# EAGLE design working (EAGLE 9.6.2)
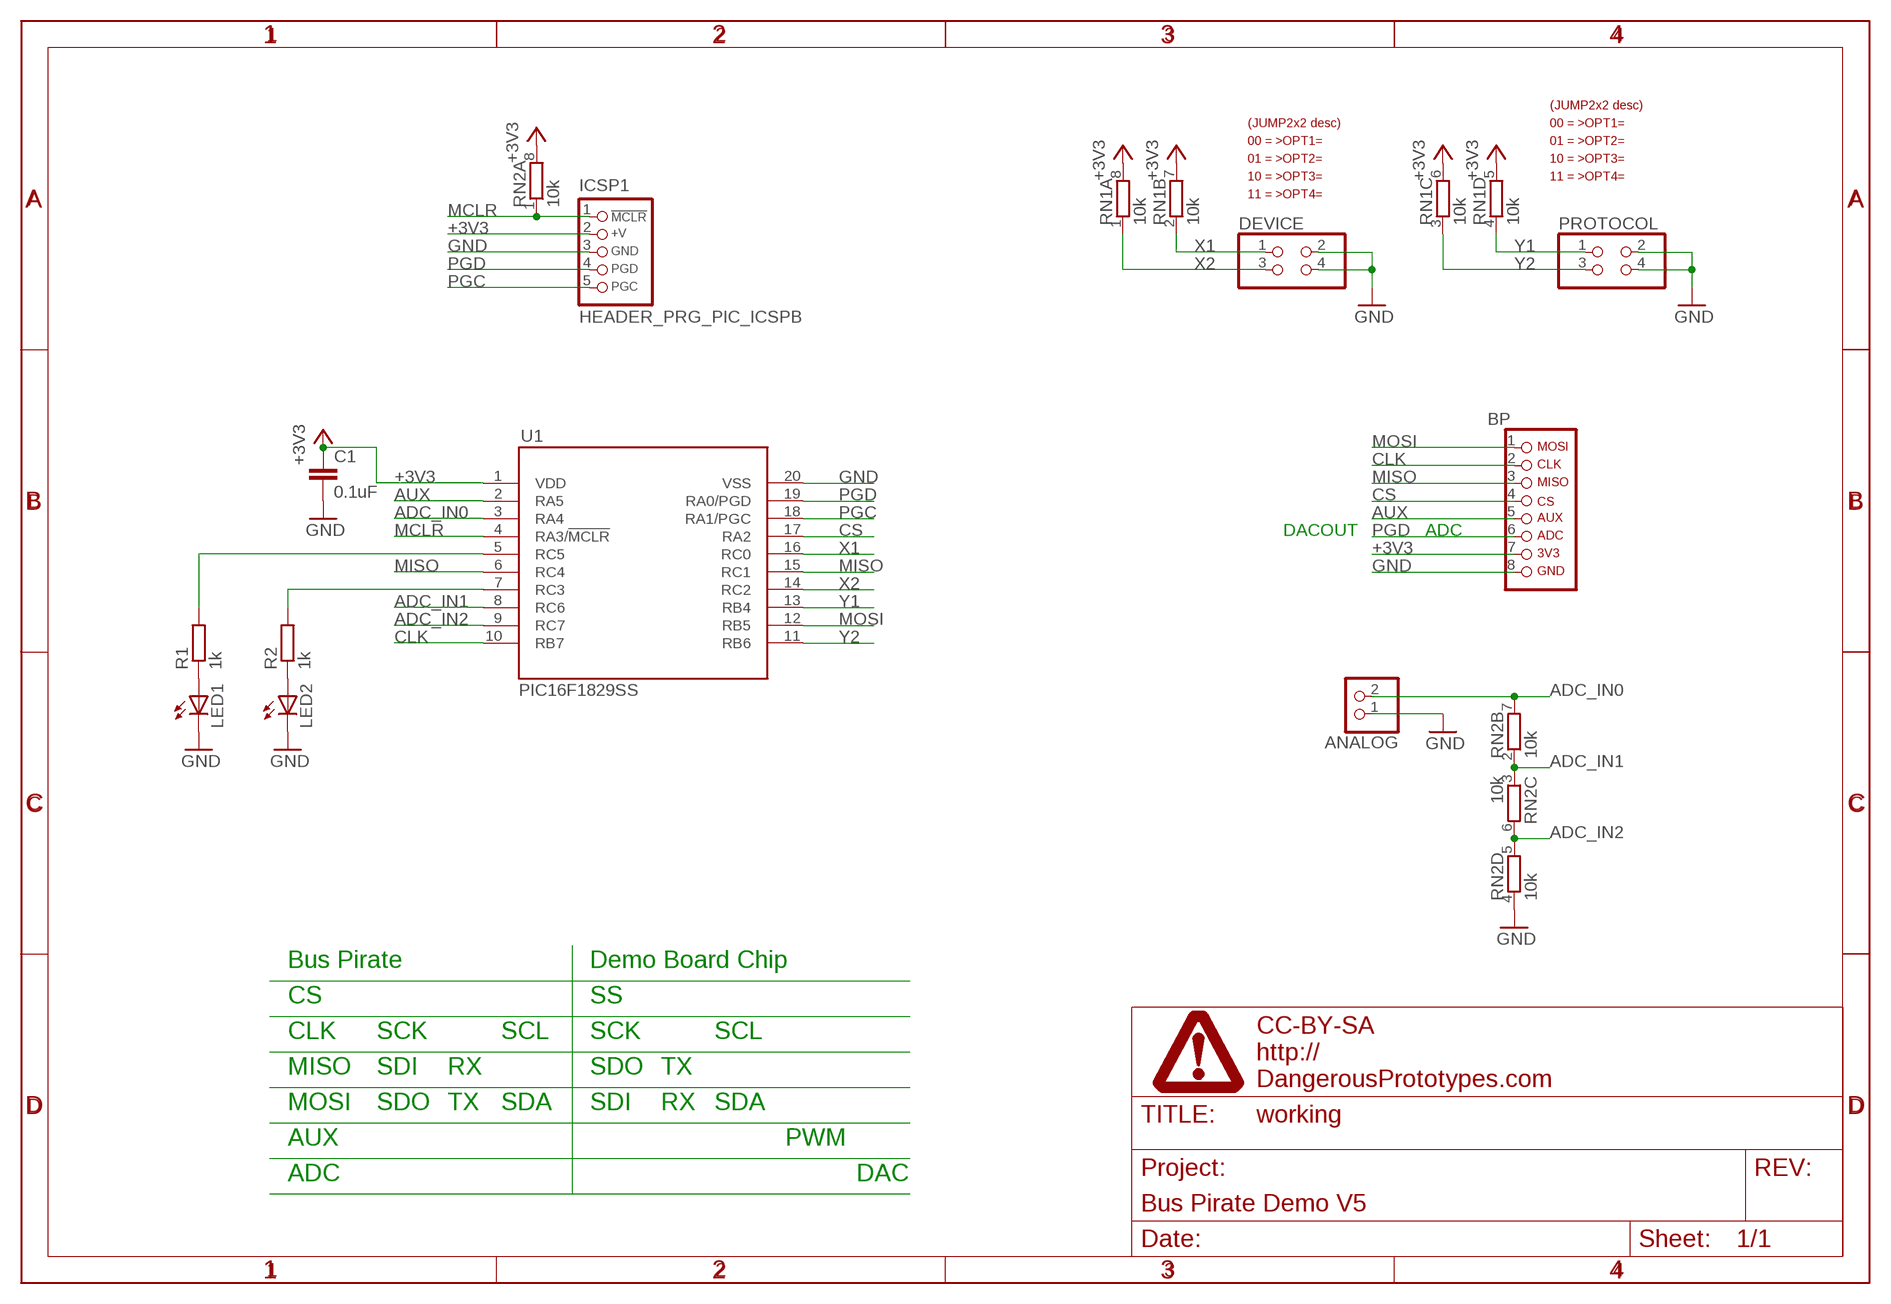
[diagram p0: schematic, sheet 1]

## Parts
ANALOG  PINHD-1X2  [1X02]
BP  HDR-BUSPIRATE  [HDR-BUSPIRATE]
C1  0.1uF  CAPC603  [C603]
DEVICE  PINHD-2X2  [2X02]
ICSP1  HEADER_PRG_PIC_ICSPB  [HEADER_PRG_1X05_ICSP_B]
LED1  LED805  [LED-805]
LED2  LED805  [LED-805]
PROTOCOL  PINHD-2X2  [2X02]
R1  1k  RESISTORR603  [R603]
R2  1k  RESISTORR603  [R603]
RN1  10k  RNETWORK  [RN8P-4R-CRA06S]
RN2  10k  RNETWORK  [RN8P-4R-CRA06S]
U1  PIC16F1829SS  [SSOP20]
U$1  DINA4_L  [DP_LOGO]
U$9  JUMP2X2_DESC  [JUMP2X2_DESC]
U$10  JUMP2X2_DESC  [JUMP2X2_DESC]

## Nets
+3V3: BP.7 C1.1 ICSP1.2(+V) RN1.5 RN1.6 RN1.7 RN1.8 RN2.8 U1.1(VDD)
ADC_IN0: ANALOG.2 RN2.7 U1.3(RA4)
ADC_IN1: RN2.2 RN2.3 U1.8(RC6)
ADC_IN2: RN2.5 RN2.6 U1.9(RC7)
AUX: BP.5 U1.2(RA5)
CLK: BP.2 U1.10(RB7)
CS: BP.4 U1.17(RA2)
GND: ANALOG.1 BP.8 C1.2 DEVICE.2 DEVICE.4 ICSP1.3(GND) LED1.C LED2.C PROTOCOL.2 PROTOCOL.4 RN2.4 U1.20(VSS)
MCLR: ICSP1.1(/MCLR) RN2.1 U1.4(RA3/!MCLR)
MISO: BP.3 U1.6(RC4) U1.15(RC1)
MOSI: BP.1 U1.12(RB5)
N$1: R1.2 U1.5(RC5)
N$2: LED1.A R1.1
N$7: LED2.A R2.1
N$10: R2.2 U1.7(RC3)
PGC: ICSP1.5(PGC) U1.18(RA1/PGC)
PGD: BP.6 ICSP1.4(PGD) U1.19(RA0/PGD)
X1: DEVICE.1 RN1.2 U1.16(RC0)
X2: DEVICE.3 RN1.1 U1.14(RC2)
Y1: PROTOCOL.1 RN1.4 U1.13(RB4)
Y2: PROTOCOL.3 RN1.3 U1.11(RB6)

## Notes on the sheet
- DACOUT | ADC
- Bus Pirate | Demo Board Chip
- CS | SS
- CLK | SCK | SCL | SCK | SCL
- MISO | SDI | RX | SDO | TX
- MOSI | SDO | TX | SDA | SDI | RX | SDA
- AUX | PWM
- ADC | DAC

## Library data of the parts
ANALOG = pinhead:PINHD-1X2: PIN HEADER
BP = dp_devices:HDR-BUSPIRATE: PIN HEADER
C1 = dp_devices:CAP
DEVICE PROTOCOL = pinhead:PINHD-2X2: PIN HEADER
ICSP1 = dp_devices:HEADER_PRG_PIC_ICSP: 5-pin PIC In Circuit Serial Programming header
LED1 LED2 = dp_devices:LED
R1 R2 = dp_devices:RESISTOR
RN1 RN2 = dp_devices:RNETWORK: 4 Resistor Array 0603
U1 = dp_devices:PIC16F1829
U$1 = dp_devices:DINA4_L: A4 DP frame Standard Dangerous Prototypes schematic frame. Automagically adds the DP logo and standard texts to the PCB Use the atrribute in the schematic editor to change the fields.; FF1: fulfillment by; FF2: Seeed Studio; FF3: www.seeedstudio.com; LICENSE: CC-BY-SA; PROJECT: Bus Pirate Demo V5; URL1: http://; URL2: DangerousPrototypes.com
U$9 = dp_devices:JUMP2X2_DESC; OPT1: SPI; OPT2: I2C; OPT3: UART; OPT4: ____
U$10 = dp_devices:JUMP2X2_DESC; OPT1: ADC; OPT2: DAC; OPT3: MEM; OPT4: PWM

## Board
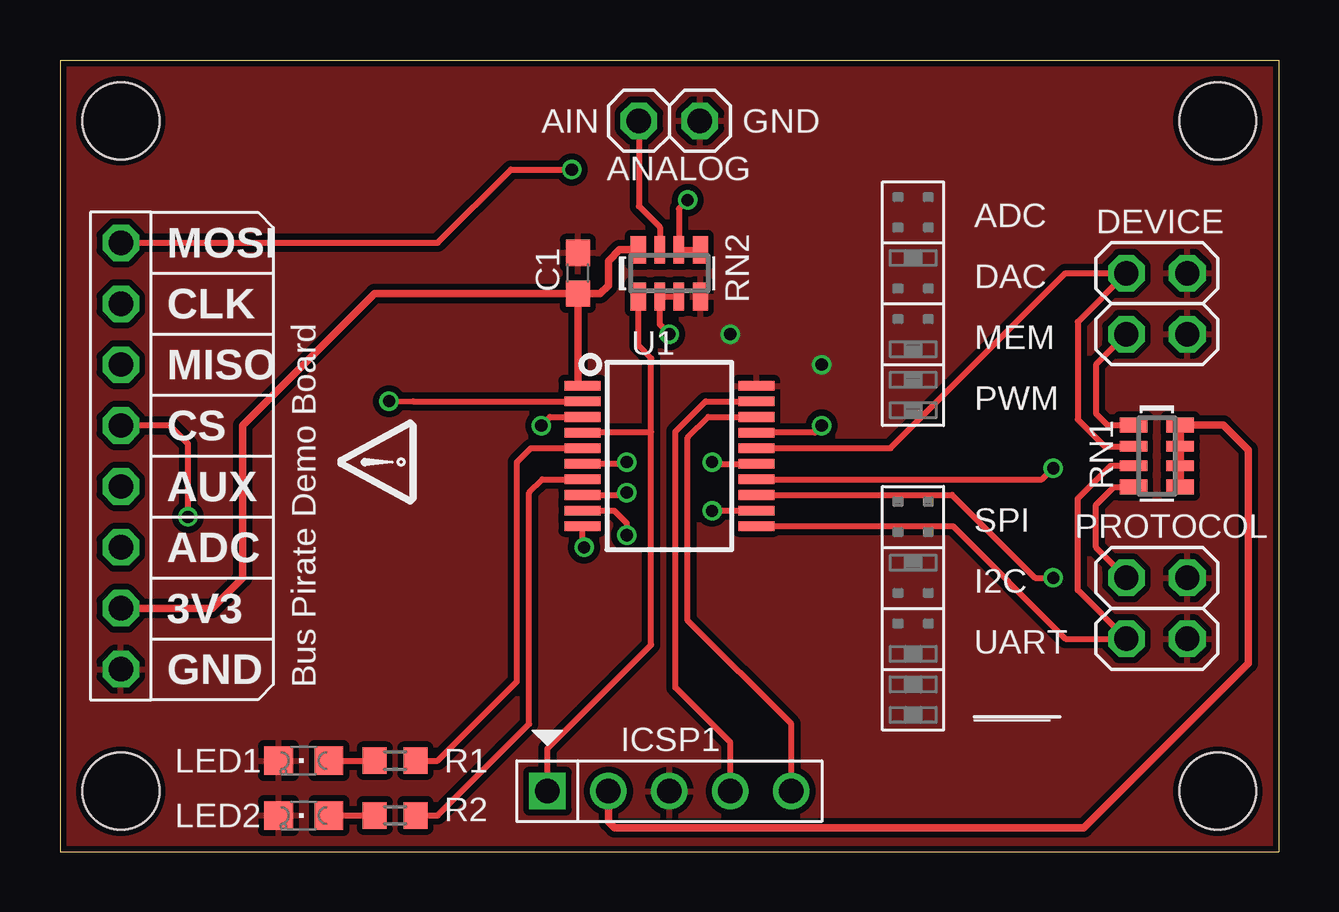
[diagram p1: board, top side]
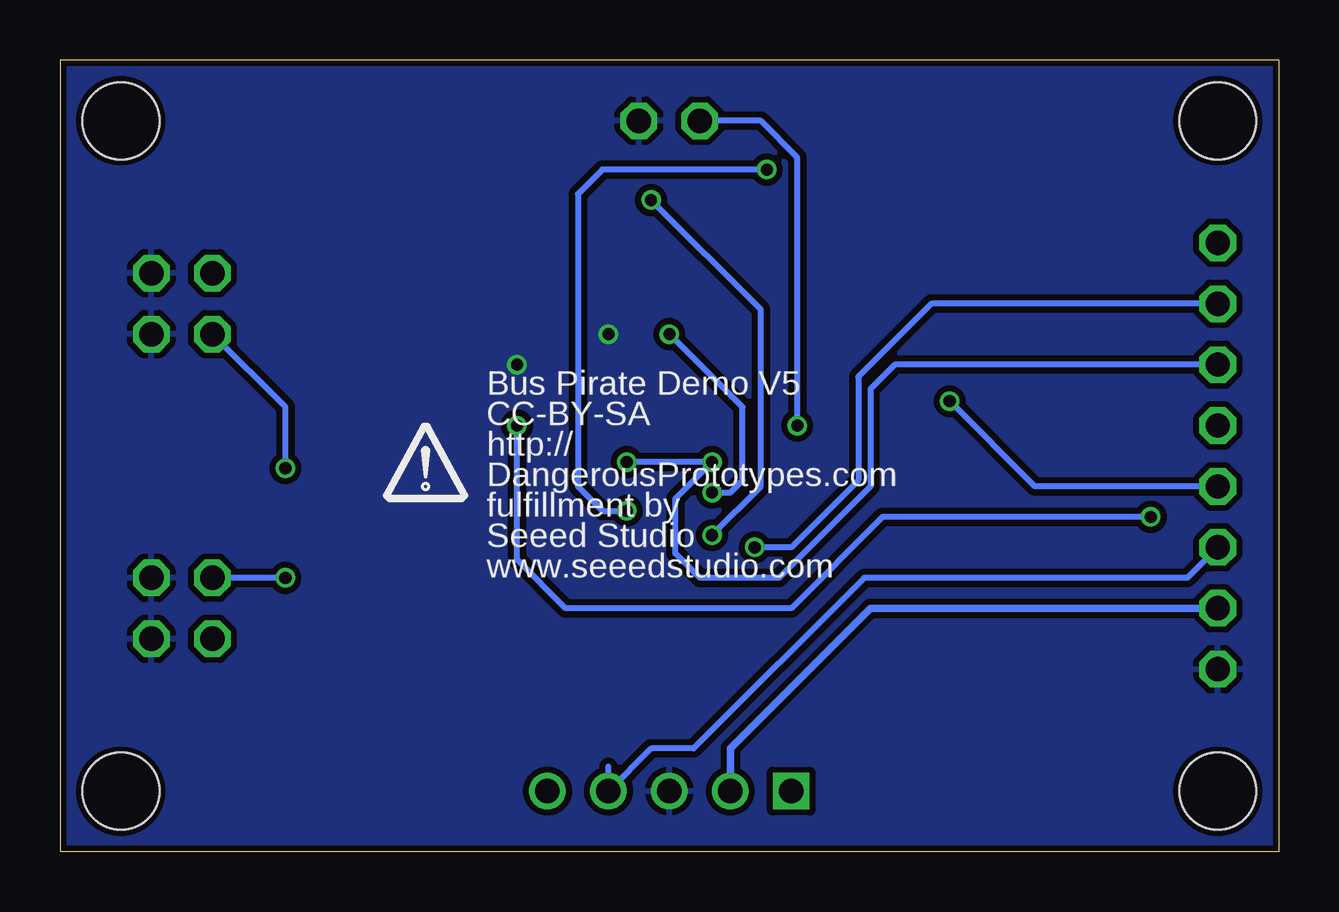
[diagram p2: board, bottom side, seen from below]

Size 50.8 x 33.02 mm. Coordinates in mm from the lower left corner, seen from the top.
Outline: 0,0 50.8,0 50.8,33.02 0,33.02 0,0
Copper layers (1*16): Top 0.035mm / dielectric 1.5mm / Bottom 0.035mm
Design rules "Fusion_eagle_rule_v1.1": minimum track width 6mil, minimum drill 12mil, track to track 6mil, track to pad 6mil, pad to pad 6mil, via to via 6mil, smd to smd 0mil, copper to edge 10mil, drill to drill 10mil, minimum pad ring 10mil, minimum via ring 6mil, stop-mask expansion 2mil, vias tented up to drill 100mil, thermal gap 10mil
Holes 3.2 mm at 2.54,2.54 48.26,2.54 48.26,30.48 2.54,30.48

### Footprints (pad centres in the part's own frame; a part is rotated, then mirrored left to right if it is on the bottom)
1X02 = drill 1.016 octagon: 1 -1.27,0; 2 1.27,0
HDR-BUSPIRATE = drill 1.016 octagon: 1 -8.89,0; 2 -6.35,0; 3 -3.81,0; 4 -1.27,0; 5 1.27,0; 6 3.81,0; 7 6.35,0; 8 8.89,0
C603 = smd 1.1 x 1: 1 -0.85,0; 2 0.85,0
2X02 = drill 1.016 octagon: 1 -1.27,-1.27; 2 -1.27,1.27; 3 1.27,-1.27; 4 1.27,1.27
HEADER_PRG_1X05_ICSP_B = drill 1.016 square: 1 -5.08,0 | drill 1.016: 2 -2.54,0; 3 0,0; 4 2.54,0; 5 5.08,0
LED-805 = smd 1.2 x 1.2: A 0,-1.05; C 0,1.05
R603 = smd 1 x 1.1: 1 -0.85,0; 2 0.85,0
RN8P-4R-CRA06S = smd 0.63 x 1.15: 1 -1.295,-0.975; 4 1.295,-0.975; 5 1.295,0.975; 8 -1.295,0.975 | smd 0.44 x 1.15: 2 -0.4,-0.975; 3 0.4,-0.975; 6 0.4,0.975; 7 -0.4,0.975
SSOP20 = smd 0.4 x 1.5: 1 -2.925,-3.625; 2 -2.275,-3.625; 3 -1.625,-3.625; 4 -0.975,-3.625; 5 -0.325,-3.625; 6 0.325,-3.625; 7 0.975,-3.625; 8 1.625,-3.625; 9 2.275,-3.625; 10 2.925,-3.625; 11 2.925,3.625; 12 2.275,3.625; 13 1.625,3.625; 14 0.975,3.625; 15 0.325,3.625; 16 -0.325,3.625; 17 -0.975,3.625; 18 -1.625,3.625; 19 -2.275,3.625; 20 -2.925,3.625

### Placement (x,y rotation side)
ANALOG  25.4,30.48 180 top
BP  2.54,16.51 270 top
C1  21.59,24.13 90 top
DEVICE  45.72,22.86 270 top
ICSP1  25.4,2.54 0 top
LED1  10.16,3.81 90 top
LED2  10.16,1.52 90 top
PROTOCOL  45.72,10.16 270 top
R1  13.97,3.81 0 top
R2  13.97,1.52 0 top
RN1  45.72,16.51 270 top
RN2  25.4,24.13 0 top
U1  25.4,16.51 270 top
U$1  14.22,16.26 90 top
U$2  DINA4_L  [DP_LOGO]  35.56,15.24 0 bottom
U$9  38.1,10.8 0 top
U$10  38.1,23.5 0 top

### Tracks (layer width: path | path; a pad name or v marks a point on that pad's centre or on a via)
+3V3
  Top 0.305: RN1.5 RN1.6 RN1.7 RN1.8 48.49,17.8 49.53,16.76 49.53,7.87 42.67,1.02 23.11,1.02 22.86,1.27 ICSP1.2 | C1.1 21.59,19.44 U1.1 | BP.7 6.35,10.16 7.62,11.43 7.62,17.78 13.12,23.28 C1.1 | RN2.8 23.33,25.11 22.86,24.64 22.86,23.62 22.52,23.28 C1.1
  Bottom 0.305: ICSP1.2 22.86,4.32 17.02,10.16 BP.7
ADC_IN0  (via drill 0.51)
  Top 0.254: ANALOG.2 24.13,26.92 25,26.05 RN2.7 | U1.3 20.42,18.14 v20.07,17.78
  Bottom 0.254: v20.07,17.78 20.07,28.96 21.59,30.48 ANALOG.2
ADC_IN1  (via drill 0.51)
  Top 0.254: RN2.3 RN2.2 25,21.99 v25.4,21.59 | v23.62,14.99 23.52,14.89 U1.8
  Bottom 0.254: v25.4,21.59 22.35,18.54 22.35,15.49 22.86,14.99 v23.62,14.99
ADC_IN2  (via drill 0.51)
  Top 0.254: RN2.5 RN2.6 25.8,26.82 v26.16,27.18 | v23.62,13.21 23.62,13.72 23.1,14.23 U1.9
  Bottom 0.254: v26.16,27.18 21.59,22.61 21.59,15.24 v23.62,13.21
AUX  (via drill 0.51)
  Top 0.254: U1.2 14.72,18.79 v13.72,18.8
  Bottom 0.254: v13.72,18.8 10.16,15.24 BP.5
CLK  (via drill 0.51)
  Top 0.254: U1.10 21.77,12.77 v21.84,12.7
  Bottom 0.254: v21.84,12.7 20.32,12.7 17.53,15.49 17.53,19.81 14.48,22.86 BP.2
CS  (via drill 0.51)
  Top 0.254: BP.4 4.57,17.78 5.33,17.02 v5.33,13.97 | v31.75,17.78 31.45,17.48 U1.17
  Bottom 0.254: v5.33,13.97 16.51,13.97 20.32,10.16 29.72,10.16 31.75,12.19 v31.75,17.78
GND  (via drill 0.51)
  other vias: 31.75,20.32 27.94,21.59
  pour Bottom (isolate 0.254): 0,0 50.8,0 50.8,33.02 0,33.02
  pour Top (isolate 0.254): 0,0 50.8,0 50.8,33.02 0,33.02
MCLR
  Top 0.254: ICSP1.1 20.32,4.32 24.64,8.64 24.64,17.53 | 24.64,17.53 24.64,20.57 24.11,21.11 RN2.1 | U1.4 24.6,17.48 24.64,17.53
MISO  (via drill 0.51)
  Top 0.254: U1.6 23.55,16.19 v23.62,16.26 | v27.18,16.26 27.25,16.19 U1.15
  Bottom 0.254: v27.18,16.26 v23.62,16.26 25.15,14.73 25.15,12.45 24.13,11.43 20.83,11.43 17.02,15.24 17.02,19.3 16,20.32 BP.3
MOSI  (via drill 0.51)
  Top 0.254: U1.12 27.19,14.23 v27.18,14.22 | v21.34,28.45 18.8,28.45 15.75,25.4 BP.1
  Bottom 0.254: v27.18,14.22 28.19,14.22 29.21,15.24 29.21,27.43 28.19,28.45 v21.34,28.45
N$1
  Top 0.254: U1.5 19.63,16.84 19.05,16.26 19.05,7.11 15.75,3.81 R1.2
N$2
  Top 0.254: LED1.A R1.1
N$7
  Top 0.254: LED2.A R2.1
N$10
  Top 0.254: U1.7 20.11,15.54 19.56,14.99 19.56,5.33 15.75,1.52 R2.2
PGC
  Top 0.254: ICSP1.5 30.48,5.33 26.16,9.65 26.16,17.27 27.02,18.14 U1.18
PGD
  Top 0.254: ICSP1.4 27.94,4.57 25.65,6.86 25.65,17.53 26.91,18.79 U1.19
  Bottom 0.254: 27.94,3.56 ICSP1.4 26.16,4.32 24.38,4.32 17.27,11.43 3.81,11.43 BP.6
X1
  Top 0.254: RN1.2 43.54,16.91 42.42,18.03 42.42,22.1 DEVICE.1 41.91,24.13 34.62,16.84 U1.16
X2  (via drill 0.51)
  Top 0.254: RN1.1 43.66,17.8 43.18,18.29 43.18,20.32 DEVICE.3 | U1.14 40.94,15.54 v41.4,16
  Bottom 0.254: v41.4,16 41.4,18.54 DEVICE.3
Y1  (via drill 0.51)
  Top 0.254: RN1.4 43.92,15.21 43.18,14.48 43.18,12.7 PROTOCOL.1 | U1.13 37.19,14.89 40.64,11.43 v41.4,11.43
  Bottom 0.254: v41.4,11.43 PROTOCOL.1
Y2
  Top 0.254: RN1.3 43.8,16.11 42.42,14.73 42.42,10.92 PROTOCOL.3 41.91,8.89 37.22,13.59 U1.11

### Text on the board
tPlace: AIN | GND | Bus Pirate Demo Board